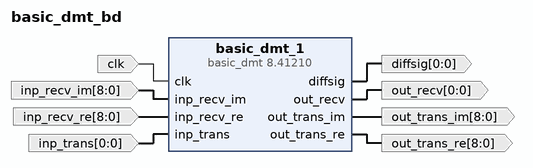
[diagram p0: block diagram of the top level]
# Vivado block design basic_dmt_bd, Vivado 2014.4
create_bd_design basic_dmt_bd

create_bd_port -dir I -type clk clk
create_bd_port -dir O -from 0 -to 0 -type data diffsig
create_bd_port -dir I -from 8 -to 0 -type data inp_recv_im
create_bd_port -dir I -from 8 -to 0 -type data inp_recv_re
create_bd_port -dir I -from 0 -to 0 -type data inp_trans
create_bd_port -dir O -from 0 -to 0 -type data out_recv
create_bd_port -dir O -from 8 -to 0 -type data out_trans_im
create_bd_port -dir O -from 8 -to 0 -type data out_trans_re

create_bd_cell -type ip -vlnv User_Company:SysGen:basic_dmt:8.41210 basic_dmt_1

# ---- connections ----

connect_bd_net [get_bd_ports clk] [get_bd_pins basic_dmt_1/clk]
connect_bd_net [get_bd_pins basic_dmt_1/diffsig] [get_bd_ports diffsig]
connect_bd_net [get_bd_ports inp_recv_im] [get_bd_pins basic_dmt_1/inp_recv_im]
connect_bd_net [get_bd_ports inp_recv_re] [get_bd_pins basic_dmt_1/inp_recv_re]
connect_bd_net [get_bd_ports inp_trans] [get_bd_pins basic_dmt_1/inp_trans]
connect_bd_net [get_bd_pins basic_dmt_1/out_recv] [get_bd_ports out_recv]
connect_bd_net [get_bd_pins basic_dmt_1/out_trans_im] [get_bd_ports out_trans_im]
connect_bd_net [get_bd_pins basic_dmt_1/out_trans_re] [get_bd_ports out_trans_re]

validate_bd_design
save_bd_design
